# EasyEDA schematic Schema.json
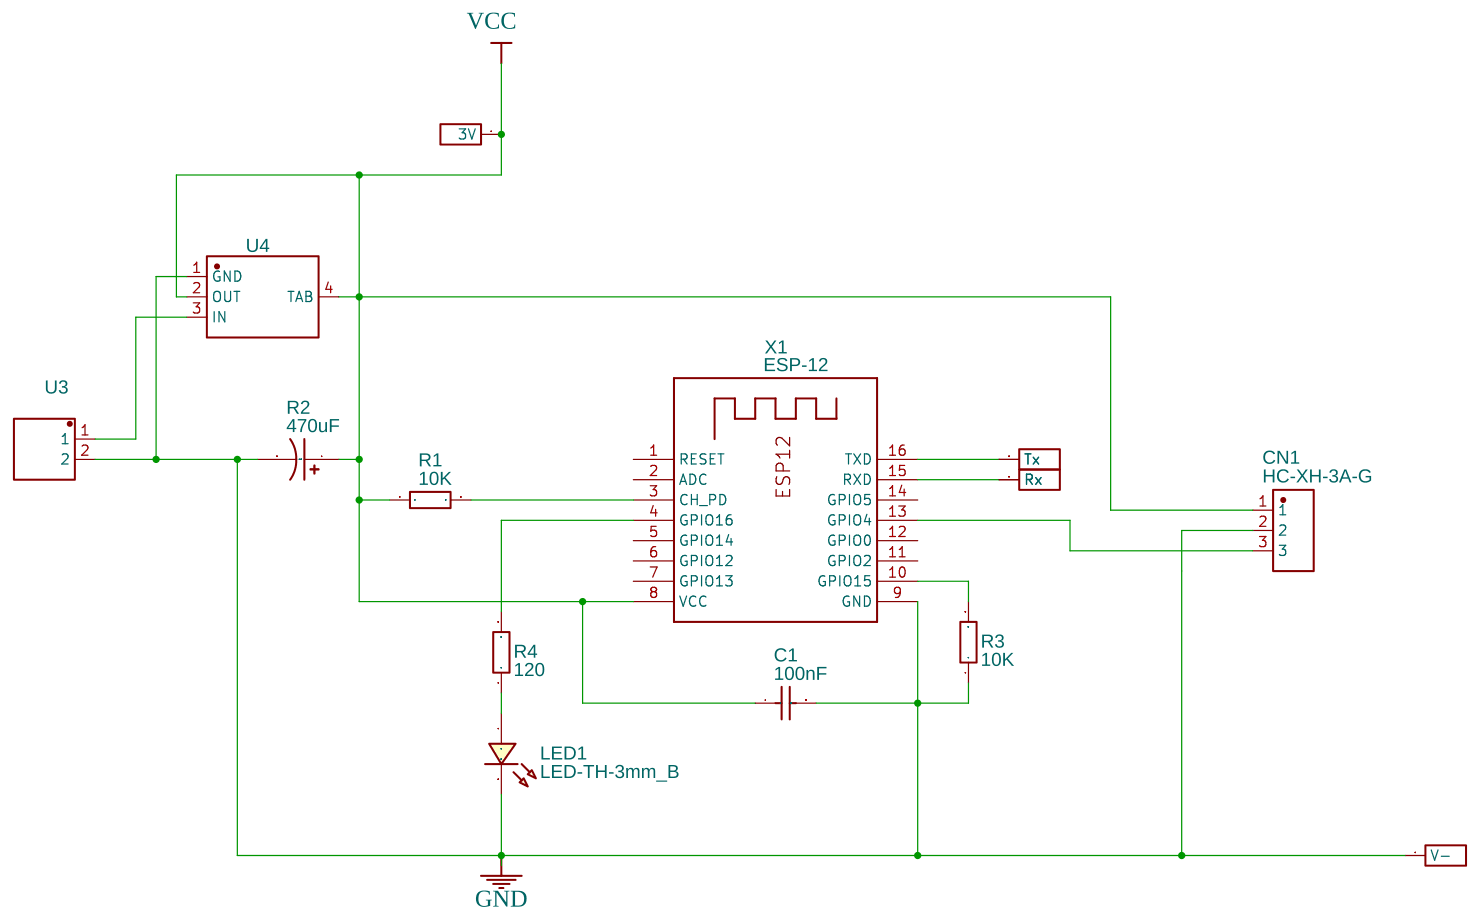
[diagram p0: schematic sheet]

## Parts
C1  100nF  [C0603]
CN1  HC-XH-3A-G  [CONN-TH_3P-P2.50_HC-XH-3A-G]
J1  HDR-M-2.54_1x1  [HDR-M-2.54_1X1]
J2  HDR-M-2.54_1x1  [HDR-M-2.54_1X1]
J3  HDR-M-2.54_1x1  [HDR-M-2.54_1X1]
J4  HDR-M-2.54_1x1  [HDR-M-2.54_1X1]
LED1  LED-TH-3mm_B  [LED-TH_BD3.0_BLUE]
R1  10K  [R0603]
R2  470uF  [C2917]
R3  10K  [R0603]
R4  120  [R0603]
U3  S2B-PH-K-S(LF)(SN)  [CONN-TH_S2B-PH-K-S(LF)(SN)]
U4  LT1117IST-2.85#TRPBF  [SOT-223-3_L6.5-W3.4-P2.30-LS7.0-BR]
X1  ESP-12  [ESP12LARGE]

## Library data of the parts
C1 = CL10B104JB8NNNC: Supplier: LCSC; Manufacturer: SAMSUNG; Supplier Part: C24452; LCSC Assembly: Yes; SMT Type: Extend
CN1 = HC-XH-3A-G: Contributor: lcsc; Supplier: LCSC; Supplier Part: C5341202; Manufacturer: HCTL(华灿天禄); JLCPCB Part Class: Extended Part; link: https://lcsc.com/eda_search?q=C5341202&%26type=1&ref=editor
J1-J4 = HDR-M-2.54_1x1: Supplier Part: C81276; Supplier: LCSC; Contributor: LCEDA_Lib
LED1 = LED-TH-3mm_B: Manufacturer: EVERLIGHT(台湾亿光); Manufacturer Part: 204-10SUBC/S400-A4; Supplier Part: C86881; Supplier: LCSC; Contributor: LCEDA_Lib
R1 R3 R4 = RK73B1JTTD103J: Supplier: LCSC; Manufacturer: KOA; Contributor: LCSC; Supplier Part: C159891
R2 = A700V106M12RATE040: Supplier: LCSC; Supplier Part: C2162687; Manufacturer: KEMET(基美); Contributor: LCSC; JLCPCB Part Class: Extended Part
U3 = S2B-PH-K-S(LF)(SN): Supplier: LCSC; Supplier Part: C173752; Manufacturer: JST Sales America; Contributor: LCSC
U4 = LT1117IST-2.85#TRPBF: Supplier: LCSC; Supplier Part: C661272; Manufacturer: Analog Devices; Contributor: LCSC
X1 = ESP-12: Contributor: Adafruit

## Nets
GND: C1.2 CN1.2 J1.1(V-) LED1.2 R2.2 R3.1 U3.2 U4.1(GND) X1.9(GND)
VCC: C1.1 CN1.1 J2.1(3V) R1.1 R2.1 U4.2(OUT) U4.4(TAB) X1.8(VCC)
Net-(CN1-3): CN1.3 X1.13(GPIO4)
Net-(J3-1): J3.1(Tx) X1.16(TXD)
Net-(J4-1): J4.1(Rx) X1.15(RXD)
Net-(LED1-1): LED1.1 R4.1
Net-(R1-2): R1.2 X1.3(CH_PD)
Net-(R3-2): R3.2 X1.10(GPIO15)
Net-(R4-2): R4.2 X1.4(GPIO16)
Net-(U3-1): U3.1 U4.3(IN)

Not connected (* = marked no-connect by the designer): X1 1(RESET) 2(ADC) 5(GPIO14) 6(GPIO12) 7(GPIO13) 11(GPIO2) 12(GPIO0) 14(GPIO5)
